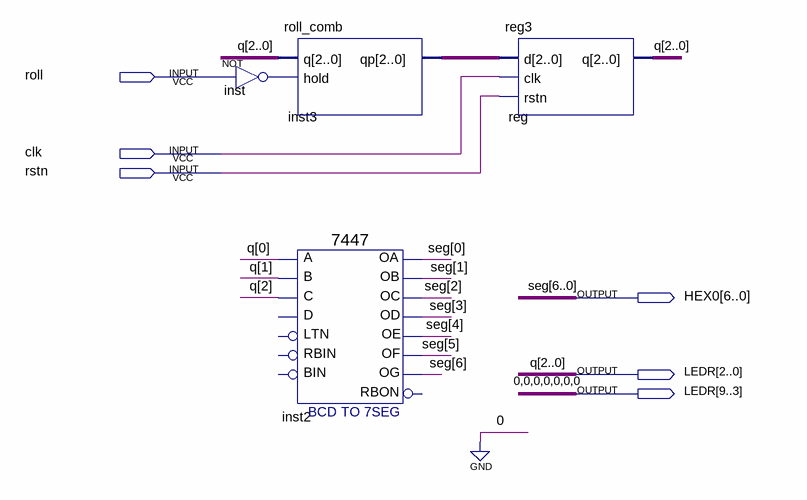
[diagram p0: schematic sheet]
// Quartus schematic roll.bdf as structural Verilog: 4 symbols, 6 pins
module roll (
  input  roll,
  input  clk,
  input  rstn,
  output [6:0] HEX0,
  output [9:0] LEDR
);

  wire inst_out;
  wire [2:0] inst3_qp;

  roll_comb inst3 (.q(LEDR[2:0]), .hold(inst_out), .qp(inst3_qp));
  not inst (inst_out, roll);
  \7447  inst2 (
    .B(LEDR[1]), .C(LEDR[2]), .A(LEDR[0]), .OB(HEX0[1]), .OC(HEX0[2]), .OE(HEX0[4]), .OD(HEX0[3]),
    .OF(HEX0[5]), .OG(HEX0[6]), .OA(HEX0[0]));  // open: LTN, D, RBIN, BIN, RBON
  reg3 \reg  (.d(inst3_qp), .clk(clk), .rstn(rstn), .q(LEDR[2:0]));

  assign LEDR[9:3] = {7{1'b0}};

  // Other names for the same wires on the sheet: q[2:0] = LEDR[2:0]; seg[6:0] = HEX0
endmodule
